# EAGLE schematic EEPROM Programmer (EAGLE 7.6.0)
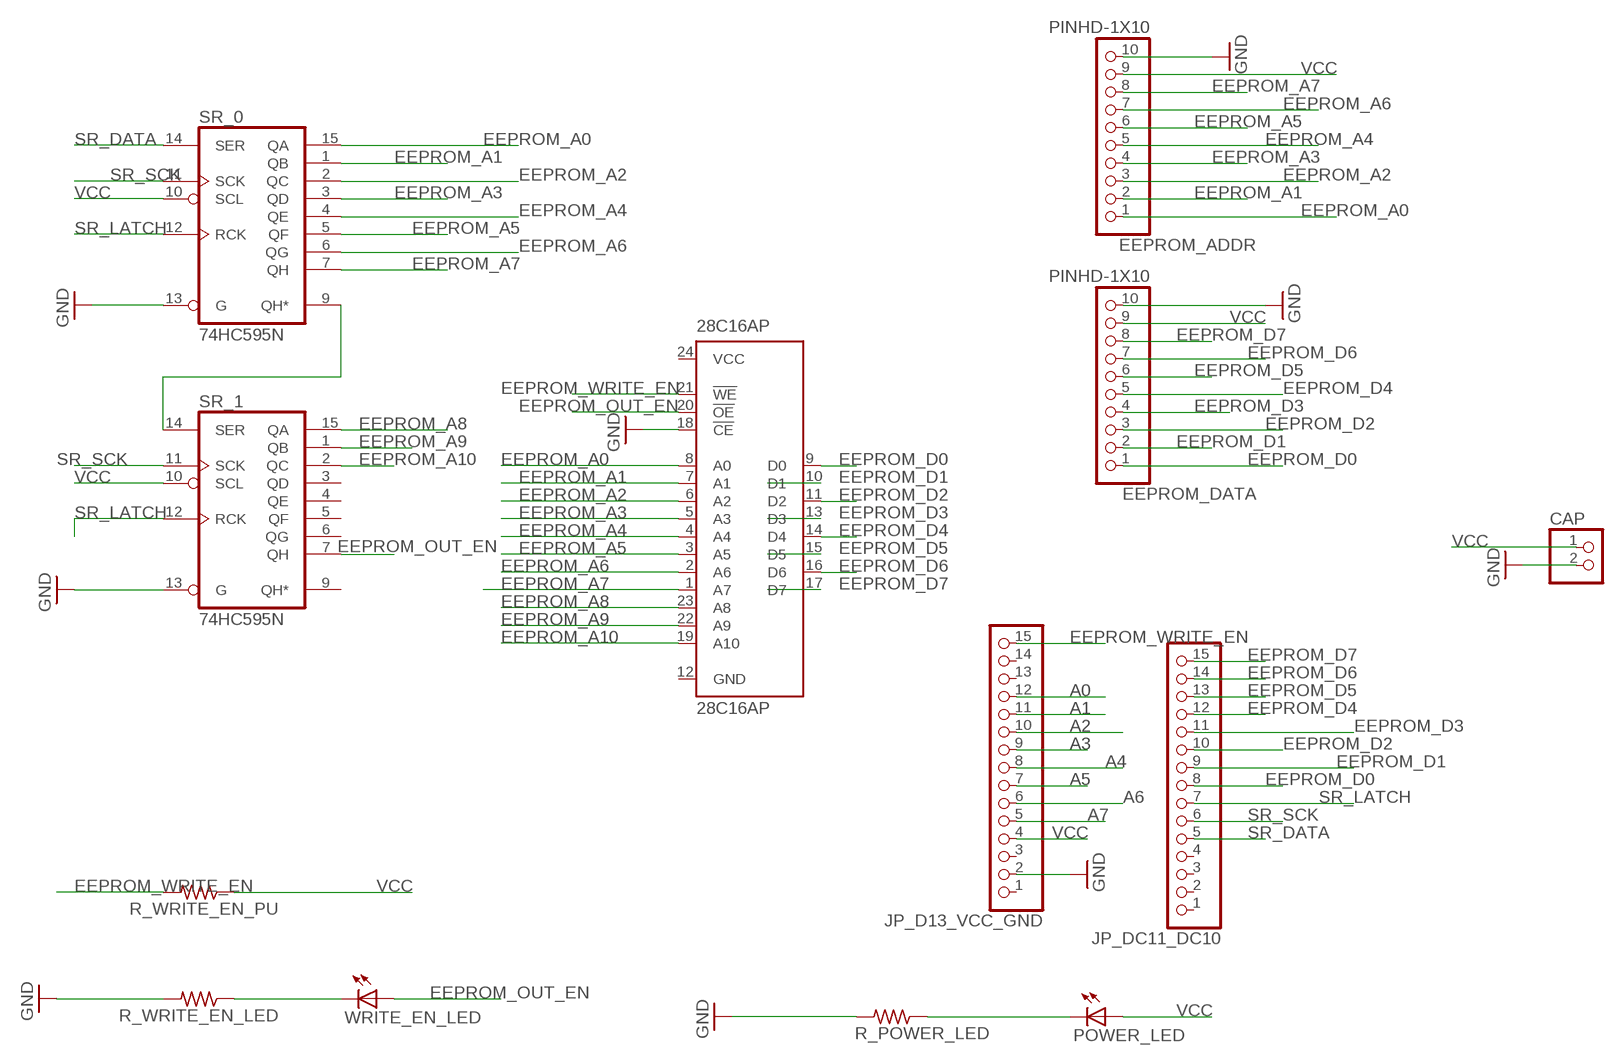
[diagram p0: schematic, sheet 1]

## Parts
28C16AP  28C16AP  [DIL24-6]
CAP  PINHD-1X2  [1X02]
EEPROM_ADDR  PINHD-1X10  [1X10-BIG]
EEPROM_DATA  PINHD-1X10  [1X10-BIG]
JP_D13_VCC_GND  PINHD-1X15  [1X15]
JP_DC11_DC10  PINHD-1X15  [1X15]
POWER_LED  LEDSMT1206  [1206]
R_POWER_LED  R-US_R1206  [R1206]
R_WRITE_EN_LED  R-US_R1206  [R1206]
R_WRITE_EN_PU  R-US_R1206  [R1206]
SR_0  74HC595N  [DIL16]
SR_1  74HC595N  [DIL16]
WRITE_EN_LED  LEDSMT1206  [1206]

## Nets
A0: JP_D13_VCC_GND.12
A1: JP_D13_VCC_GND.11
A2: JP_D13_VCC_GND.10
A3: JP_D13_VCC_GND.9
A4: JP_D13_VCC_GND.8
A5: JP_D13_VCC_GND.7
A6: JP_D13_VCC_GND.6
A7: JP_D13_VCC_GND.5
EEPROM_A0: 28C16AP.8(A0) EEPROM_ADDR.1 SR_0.15(QA)
EEPROM_A1: 28C16AP.7(A1) EEPROM_ADDR.2 SR_0.1(QB)
EEPROM_A2: 28C16AP.6(A2) EEPROM_ADDR.3 SR_0.2(QC)
EEPROM_A3: 28C16AP.5(A3) EEPROM_ADDR.4 SR_0.3(QD)
EEPROM_A4: 28C16AP.4(A4) EEPROM_ADDR.5 SR_0.4(QE)
EEPROM_A5: 28C16AP.3(A5) EEPROM_ADDR.6 SR_0.5(QF)
EEPROM_A6: 28C16AP.2(A6) EEPROM_ADDR.7 SR_0.6(QG)
EEPROM_A7: 28C16AP.1(A7) EEPROM_ADDR.8 SR_0.7(QH)
EEPROM_A8: 28C16AP.23(A8) SR_1.15(QA)
EEPROM_A9: 28C16AP.22(A9) SR_1.1(QB)
EEPROM_A10: 28C16AP.19(A10) SR_1.2(QC)
EEPROM_D0: 28C16AP.9(D0) EEPROM_DATA.1 JP_DC11_DC10.8
EEPROM_D1: 28C16AP.10(D1) EEPROM_DATA.2 JP_DC11_DC10.9
EEPROM_D2: 28C16AP.11(D2) EEPROM_DATA.3 JP_DC11_DC10.10
EEPROM_D3: 28C16AP.13(D3) EEPROM_DATA.4 JP_DC11_DC10.11
EEPROM_D4: 28C16AP.14(D4) EEPROM_DATA.5 JP_DC11_DC10.12
EEPROM_D5: 28C16AP.15(D5) EEPROM_DATA.6 JP_DC11_DC10.13
EEPROM_D6: 28C16AP.16(D6) EEPROM_DATA.7 JP_DC11_DC10.14
EEPROM_D7: 28C16AP.17(D7) EEPROM_DATA.8 JP_DC11_DC10.15
EEPROM_OUT_EN: 28C16AP.20(!OE) SR_1.7(QH) WRITE_EN_LED.A
EEPROM_WRITE_EN: 28C16AP.21(!WE) JP_D13_VCC_GND.15 R_WRITE_EN_PU.2
GND: 28C16AP.18(!CE) CAP.2 EEPROM_ADDR.10 EEPROM_DATA.10 JP_D13_VCC_GND.2 R_POWER_LED.2 R_WRITE_EN_LED.2 SR_0.13(G) SR_1.13(G)
N$1: POWER_LED.C R_POWER_LED.1
N$2: R_WRITE_EN_LED.1 WRITE_EN_LED.C
N$4: SR_0.9(QH*) SR_1.14(SER)
SR_DATA: JP_DC11_DC10.5 SR_0.14(SER)
SR_LATCH: JP_DC11_DC10.7 SR_0.12(RCK) SR_1.12(RCK)
SR_SCK: JP_DC11_DC10.6 SR_0.11(SCK) SR_1.11(SCK)
VCC: CAP.1 EEPROM_ADDR.9 EEPROM_DATA.9 JP_D13_VCC_GND.4 POWER_LED.A R_WRITE_EN_PU.1 SR_0.10(SCL) SR_1.10(SCL)
Unconnected: JP_D13_VCC_GND.1 JP_D13_VCC_GND.3 JP_D13_VCC_GND.13 JP_D13_VCC_GND.14 JP_DC11_DC10.1 JP_DC11_DC10.2 JP_DC11_DC10.3 JP_DC11_DC10.4 SR_1.3(QD) SR_1.4(QE) SR_1.5(QF) SR_1.6(QG) SR_1.9(QH*)

## Power pins joined to a net without a drawn wire
GND: 28C16AP.12(GND) SR_0.8(GND) SR_1.8(GND)
VCC: 28C16AP.24(VCC) SR_0.16(VCC) SR_1.16(VCC)

## Library data of the parts
28C16AP = microchip:28*16A: CMOS EPROM 16 K (2 K x 8) Source: ww1.microchip.com/downloads/en/DeviceDoc/11125J.pdf; MPN: CAT28C16ALI-12; OC_FARNELL: 1718292; OC_NEWARK: 06R0648
CAP = pinhead:PINHD-1X2: PIN HEADER
EEPROM_ADDR EEPROM_DATA = adafruit:PINHD-1X10: Pin header 1x10 0.1" spacing With round pins
JP_D13_VCC_GND JP_DC11_DC10 = adafruit:PINHD-1X15: PIN HEADER
POWER_LED WRITE_EN_LED = adafruit:LED: LED OSRAM: - CHIPLED LG R971, LG N971, LY N971, LG Q971, LY Q971, LO R971, LY R971 LH N974, LH R974 LS Q976, LO Q976, LY Q976 LO Q996 - Hyper CHIPLED LW Q18S LB Q993, LB Q99A, LB R99A - SideLED LS A670, LO A670, LY A670, LG A670, LP A670 LB A673, LV A673, LT A673, LW A673 LH A674 LY A675 LS A676, LA A676, LO A676, LY A676, LW A676 LS A679, LY A679, LG A679 - Hyper Micro SIDELED® LS Y876, LA Y876, LO Y876, LY Y876 LT Y87S - SmartLED LW L88C, LW L88S LB L89C, LB L89S, LG L890 LS L89K, LO L89K, LY L89K LS L896, LA L896, LO L896, LY L896 - TOPLED LS T670, LO T670, LY T670, LG T670, LP T670 LSG T670, LSP T670, LSY T670, LOP T670, LYG T670 LG T671, LOG T671, LSG T671 LB T673, LV T673, LT T673, LW T673 LH T674 LS T676, LA T676, LO T676, LY T676, LB T676, LH T676, LSB T676, LW T676 LB T67C, LV T67C, LT T67C, LS T67K, LO T67K, LY T67K, LW E67C LS E67B, LA E67B, LO E67B, LY E67B, LB E67C, LV E67C, LT E67C LW T67C LS T679, LY T679, LG T679 LS T770, LO T770, LY T770, LG T770, LP T770 LB T773, LV T773, LT T773, LW T773 LH T774 LS E675, LA E675, LY E675, LS T675 LS T776, LA T776, LO T776, LY T776, LB T776 LHGB T686 LT T68C, LB T68C - Hyper Mini TOPLED® LB M676 - Mini TOPLED Santana® LG M470 LS M47K, LO M47K, LY M47K Source: http://www.osram.convergy.de/
R_POWER_LED R_WRITE_EN_LED R_WRITE_EN_PU = adafruit:R-US_: RESISTOR, American symbol
SR_0 SR_1 = 74xx-eu:74*595: 8-bit SHIFT REGISTER, output latch